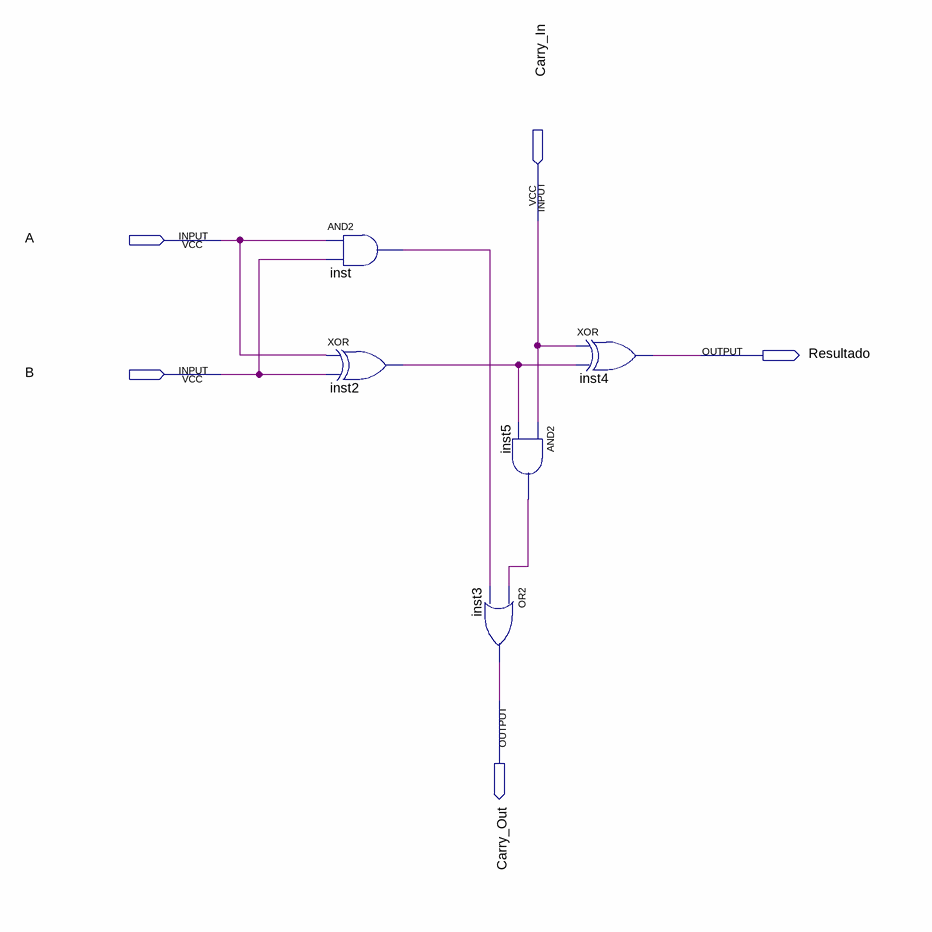
[diagram p0: schematic sheet]
// Quartus schematic somadorCompleto.bdf as structural Verilog: 5 symbols, 5 pins
module somadorCompleto (
  input  Carry_In,
  input  A,
  input  B,
  output Resultado,
  output Carry_Out
);

  wire inst2_out, inst5_out, inst_out;

  and inst (inst_out, A, B);
  xor inst2 (inst2_out, A, B);
  and inst5 (inst5_out, Carry_In, inst2_out);
  or inst3 (Carry_Out, inst5_out, inst_out);
  xor inst4 (Resultado, Carry_In, inst2_out);
endmodule
